# Altium schematic sheet Communication.SchDoc
size A4; SheetNumber: 2; SheetTotal: 4
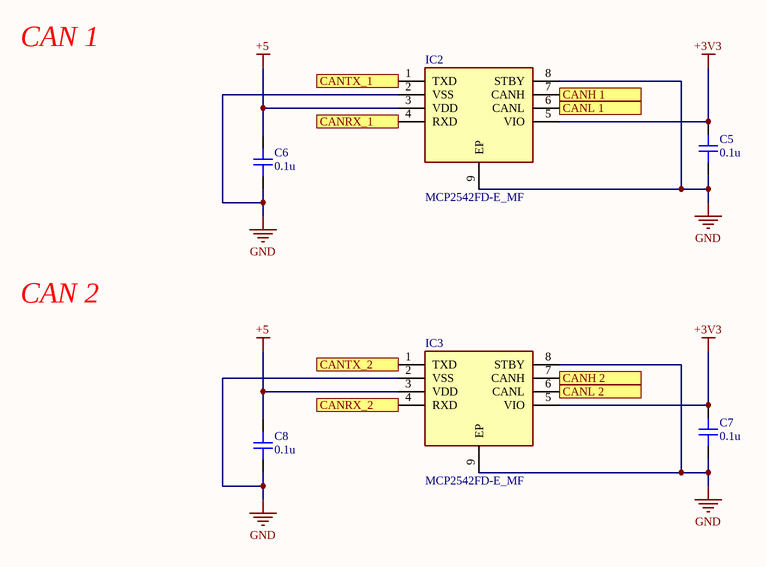
[diagram p0: Communication.SchDoc]

## Parts
C5  0.1u  [CAP_0805]
C6  0.1u  [CAP_0805]
C7  0.1u  [CAP_0805]
C8  0.1u  [CAP_0805]
IC2  MCP2542FD-E_MF  [SON65P300X300X100-9N-D]
IC3  MCP2542FD-E_MF  [SON65P300X300X100-9N-D]

## Ports
CANH 1 (see Dynamics_Sch[1B]), CANH 2 (see Dynamics_Sch[1B]), CANL 1 (see Dynamics_Sch[1B]), CANL 2 (see Dynamics_Sch[1C]), CANRX_1 (see Dynamics_Sch[6B]), CANRX_2 (see Dynamics_Sch[6B]), CANTX_1 (see Dynamics_Sch[6B]), CANTX_2 (see Dynamics_Sch[6B])

## Nets
+3V3: C5.2 C7.2 IC2.5(VIO) IC3.5(VIO)
+5: C6.2 C8.2 IC2.3(VDD) IC3.3(VDD)
GND: C5.1 C6.1 C7.1 C8.1 IC2.2(VSS) IC2.8(STBY) IC2.9(EP) IC3.2(VSS) IC3.8(STBY) IC3.9(EP)
CANH 1: IC2.7(CANH) ; port CANH 1
CANH 2: IC3.7(CANH) ; port CANH 2
CANL 1: IC2.6(CANL) ; port CANL 1
CANL 2: IC3.6(CANL) ; port CANL 2
CANRX_1: IC2.4(RXD) ; port CANRX_1
CANRX_2: IC3.4(RXD) ; port CANRX_2
CANTX_1: IC2.1(TXD) ; port CANTX_1
CANTX_2: IC3.1(TXD) ; port CANTX_2

## Notes on the sheet
- CAN 1
- CAN 2

## Library data of the parts
C5-C8 = CAP_0805_10V: Capacitor SMD 0805 10V
IC2 IC3 = MCP2542FD-E_MF: Integrated Circuit; Manufacturer_Name: Microchip; Manufacturer_Part_Number: MCP2542FD-E/MF; Datasheet Link: http://ww1.microchip.com/downloads/en/devicedoc/20005514a.pdf; Height: 1mm; Mouser Part Number: 579-MCP2542FD-E/MF; Mouser Price/Stock: https://www.mouser.co.uk/ProductDetail/Microchip-Technology-Atmel/MCP2542FD-E-MF?qs=l7cgNqFNU1jog4BwTzULBw%3D%3D; Arrow Part Number: MCP2542FD-E/MF; Arrow Price/Stock: https://www.arrow.com/en/products/mcp2542fd-emf/microchip-technology?region=nac